# EAGLE design e-box (EAGLE 7.6.0)
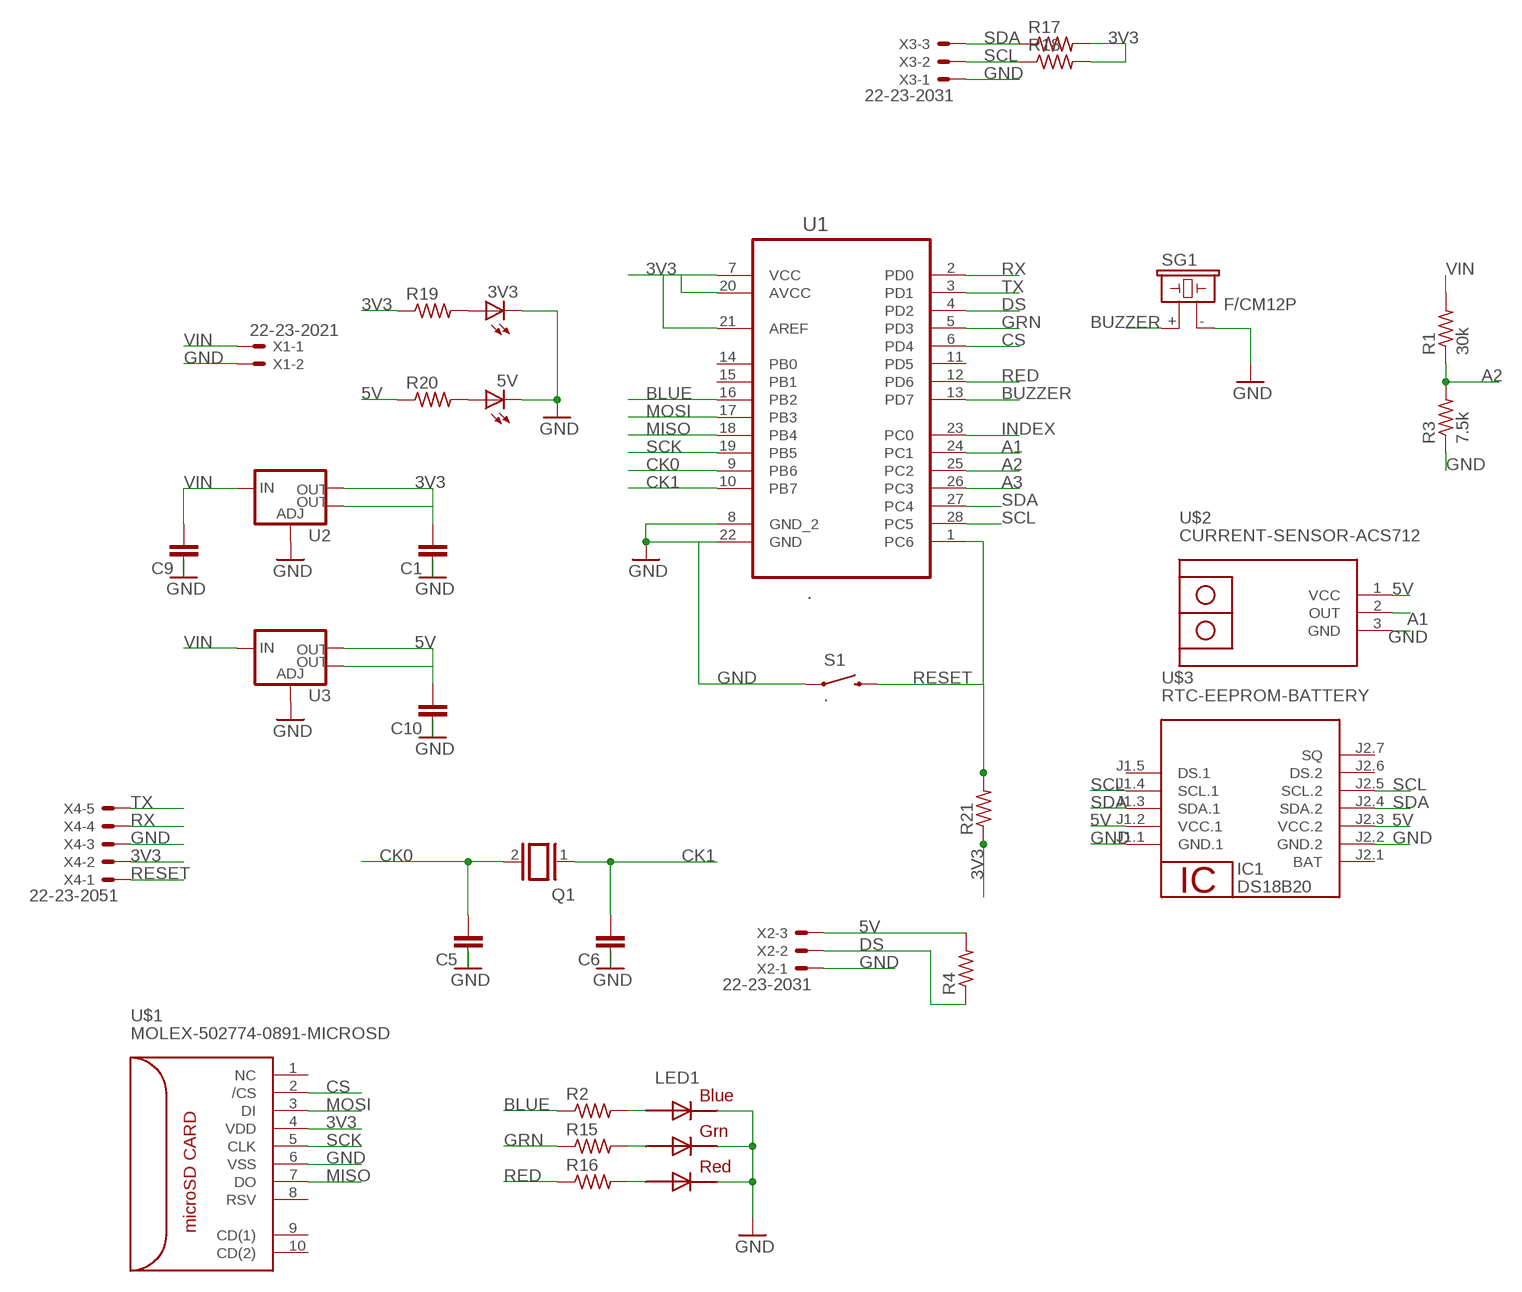
[diagram p0: schematic, sheet 1]

## Parts
3V3  LEDSMT1206  [1206]
5V  LEDSMT1206  [1206]
C1  10UF-1210-50V-20%  [1210]
C5  10UF-1210-50V-20%  [1210]
C6  10UF-1210-50V-20%  [1210]
C9  10UF-1210-50V-20%  [1210]
C10  10UF-1210-50V-20%  [1210]
IC1  DS18B20  [TO92-]
LED1  .  RGBLED5050  [RGBLED5050]
Q1  XTAL/S  [QS]
R1  30k  R-US_M1206  [M1206]
R2  R-US_M1206  [M1206]
R3  7.5k  R-US_M1206  [M1206]
R4  R-US_M1206  [M1206]
R15  R-US_M1206  [M1206]
R16  R-US_M1206  [M1206]
R17  R-US_M1206  [M1206]
R18  R-US_M1206  [M1206]
R19  R-US_M1206  [M1206]
R20  R-US_M1206  [M1206]
R21  R-US_M1206  [M1206]
S1  .  SWITCH-MOMENTARY-2SMD-1101NE  [TACTILE-SWITCH-1101NE]
SG1  F/CM12P  [F/CM12P]
U1  .  ATMEGA328P-PU  [DIP254P762X457-28]
U2  V_REG_LM1117SOT223  [SOT223]
U3  V_REG_LM1117SOT223  [SOT223]
U$1  MOLEX-502774-0891-MICROSD  [MOLEX-502774-0891-MICROSD]
U$2  CURRENT-SENSOR-ACS712  [CURRENT-SENSOR-ACS712]
U$3  RTC-EEPROM-BATTERY  [RTC-EEPROM-BATTERY]
X1  22-23-2021  [22-23-2021]
X2  22-23-2031  [22-23-2031]
X3  22-23-2031  [22-23-2031]
X4  22-23-2051  [22-23-2051]

## Nets
3V3: C1.2 R17.2 R18.2 R19.1 R21.1 U1.7(VCC) U1.20(AVCC) U1.21(AREF) U2.2(OUT) U2.4(OUT) U$1.4(VDD) X4.2
5V: C10.2 R4.2 R20.1 U3.2(OUT) U3.4(OUT) U$2.1(VCC) U$3.J1.2(VCC.1) U$3.J2.3(VCC.2) X2.3
A1: U1.24(PC1) U$2.2(OUT)
A2: R1.1 R3.2 U1.25(PC2)
A3: U1.26(PC3)
BLUE: R2.1 U1.16(PB2)
BUZZER: SG1.+ U1.13(PD7)
CK0: C5.2 Q1.2 U1.9(PB6)
CK1: C6.2 Q1.1 U1.10(PB7)
CS: U1.6(PD4) U$1.2(/CS)
DS: R4.1 U1.4(PD2) X2.2
GND: 3V3.C 5V.C C1.1 C5.1 C6.1 C9.1 C10.1 LED1.4(BLUE_C) LED1.5(RED_C) LED1.6(GREEN_C) R3.1 S1.1 SG1.- U1.8(GND_2) U1.22(GND) U2.1(ADJ) U3.1(ADJ) U$1.6(VSS) U$2.3(GND) U$3.J1.1(GND.1) U$3.J2.2(GND.2) X1.2 X2.1 X3.1 X4.3
GRN: R15.1 U1.5(PD3)
INDEX: U1.23(PC0)
MISO: U1.18(PB4) U$1.7(DO)
MOSI: U1.17(PB3) U$1.3(DI)
N$7: LED1.3(BLUE_A) R2.2
N$8: LED1.1(GREEN_A) R15.2
N$9: LED1.2(RED_A) R16.2
N$11: 3V3.A R19.2
N$12: 5V.A R20.2
RED: R16.1 U1.12(PD6)
RESET: R21.2 S1.2 U1.1(PC6) X4.1
RX: U1.2(PD0) X4.4
SCK: U1.19(PB5) U$1.5(CLK)
SCL: R18.1 U1.28(PC5) U$3.J1.4(SCL.1) U$3.J2.5(SCL.2) X3.2
SDA: R17.1 U1.27(PC4) U$3.J1.3(SDA.1) U$3.J2.4(SDA.2) X3.3
TX: U1.3(PD1) X4.5
VIN: C9.2 R1.2 U2.3(IN) U3.3(IN) X1.1
Unconnected: U1.11(PD5) U1.14(PB0) U1.15(PB1) U$1.1(NC) U$1.8(RSV) U$1.9(CD(1)) U$1.10(CD(2)) U$3.J1.5(DS.1) U$3.J2.1(BAT) U$3.J2.6(DS.2) U$3.J2.7(SQ)

## Power pins joined to a net without a drawn wire
1W: IC1.2
GND: IC1.1
VDD: IC1.3

## Library data of the parts
3V3 5V = adafruit:LED: LED OSRAM: - CHIPLED LG R971, LG N971, LY N971, LG Q971, LY Q971, LO R971, LY R971 LH N974, LH R974 LS Q976, LO Q976, LY Q976 LO Q996 - Hyper CHIPLED LW Q18S LB Q993, LB Q99A, LB R99A - SideLED LS A670, LO A670, LY A670, LG A670, LP A670 LB A673, LV A673, LT A673, LW A673 LH A674 LY A675 LS A676, LA A676, LO A676, LY A676, LW A676 LS A679, LY A679, LG A679 - Hyper Micro SIDELED® LS Y876, LA Y876, LO Y876, LY Y876 LT Y87S - SmartLED LW L88C, LW L88S LB L89C, LB L89S, LG L890 LS L89K, LO L89K, LY L89K LS L896, LA L896, LO L896, LY L896 - TOPLED LS T670, LO T670, LY T670, LG T670, LP T670 LSG T670, LSP T670, LSY T670, LOP T670, LYG T670 LG T671, LOG T671, LSG T671 LB T673, LV T673, LT T673, LW T673 LH T674 LS T676, LA T676, LO T676, LY T676, LB T676, LH T676, LSB T676, LW T676 LB T67C, LV T67C, LT T67C, LS T67K, LO T67K, LY T67K, LW E67C LS E67B, LA E67B, LO E67B, LY E67B, LB E67C, LV E67C, LT E67C LW T67C LS T679, LY T679, LG T679 LS T770, LO T770, LY T770, LG T770, LP T770 LB T773, LV T773, LT T773, LW T773 LH T774 LS E675, LA E675, LY E675, LS T675 LS T776, LA T776, LO T776, LY T776, LB T776 LHGB T686 LT T68C, LB T68C - Hyper Mini TOPLED® LB M676 - Mini TOPLED Santana® LG M470 LS M47K, LO M47K, LY M47K Source: http://www.osram.convergy.de/
C1 C5 C6 C9 C10 = SparkFun-Capacitors:10UF: 10.0µF ceramic capacitors A capacitor is a passive two-terminal electrical component used to store electrical energy temporarily in an electric field.; PROD_ID: CAP-09824; VALUE: 10uF
IC1 = 1wire:DS18B20: Programmable Resolution Digital Thermometer This chip provides a onewire thermosensor with approx. 0.5°C accuracy. A programmable over/undertemperure alarm is available. The precision can be set from 9..12 bits. Notes: Vdd must be applied for accurate measurements at low temperatures, as the parasite power circuit otherwise heats the sensor. If parasite power is used, Vdd has to be connected to GND. The DS1822 is a low-cost thermometer chip, the DS18S20 is similar to the DS18B20, but with 9 Bit precision only. Author: Jan Kandziora <jjj@gmx.de>
LED1 = adafruit:RGBLED: For 5050 RGB LEDs, the order of the LEDs may vary from one manufacturer to another!
Q1 = special:XTAL/S: CRYSTAL
R1-R4 R15-R21 = adafruit:R-US_: RESISTOR, American symbol
S1 = SparkFun-Electromechanical:SWITCH-MOMENTARY-2: Various NO switches- pushbuttons, reed, etc; PROD_ID: SWCH-00815
SG1 = buzzer:F/CM12P: BUZZER Source: Buerklin; OC_FARNELL: unknown; OC_NEWARK: unknown
U1 = Atmel_By_element14_Batch_1-00:ATMEGA328P-PU: 8-bit Microcontroller with In-System Programmable Flash; MPN: ATMEGA328P-PU; OC_FARNELL: 1715487; OC_NEWARK: 15R0268; PACKAGE: PDIP-28; SUPPLIER: Atmel
U2 U3 = SparkFun-IC-Power:V_REG_LM1117: Voltage Regulator LM1117 Standard adjustable voltage regulator but in SMD form. Spark Fun Electronics SKU : COM-00595; PROD_ID: VREG-08170
U$1 = Ava:MOLEX-502774-0891-MICROSD; FARNELL: 2064063
U$2 = diy-modules:CURRENT-SENSOR-ACS712: Isolated Bipolar Current Sensors based on ACS712 chip More details available here: http://embedded-lab.com/blog/a-brief-overview-of-allegro-acs712-current-sensor-part-1/ Click here to find device on ebay.com <http://www.ebay.com/sch/acs712+module> Note: There are many available versions with different pinout. Please check before use
U$3 = diy-modules:RTC-EEPROM-BATTERY: RTC Module with Battery and EEPROM based on DS1307 and AT24C32 chips More details available here: http://henrysbench.capnfatz.com/henrys-bench/arduino-sensors-and-input/arduino-tiny-rtc-d1307-tutorial/ Click here to find device on ebay.com <http://www.ebay.com/sch/tiny+rtc+arduino>
X1 = con-molex:22-23-2021: .100" (2.54mm) Center Header - 2 Pin; MF: MOLEX; MPN: 22-23-2021; OC_FARNELL: 1462926; OC_NEWARK: 25C3832
X2 X3 = con-molex:22-23-2031: .100" (2.54mm) Center Header - 3 Pin; MF: MOLEX; MPN: 22-23-2031; OC_FARNELL: 1462950; OC_NEWARK: 30C0862
X4 = con-molex:22-23-2051: .100" (2.54mm) Center Header - 5 Pin; MF: MOLEX; MPN: 22-23-2051; OC_FARNELL: 1462952; OC_NEWARK: 38C9178

## Net classes
0 default: width 0.406 mm

## Board
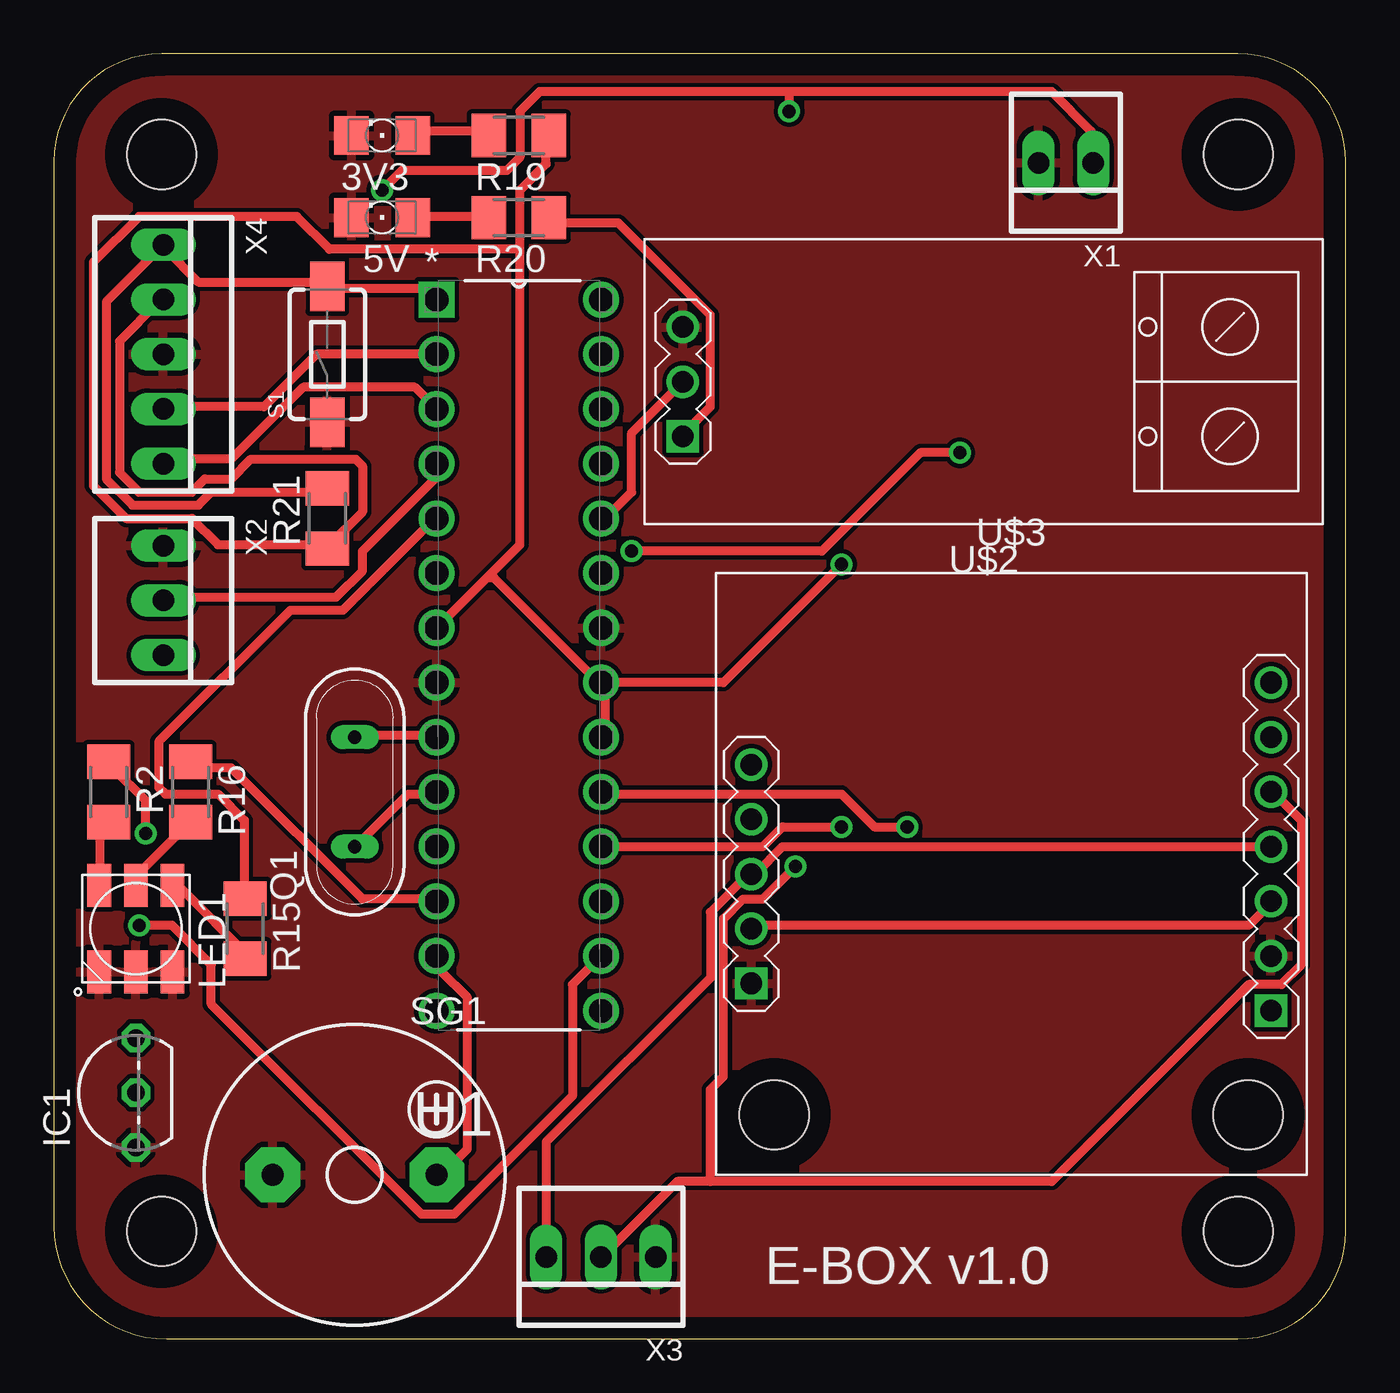
[diagram p1: board, top side]
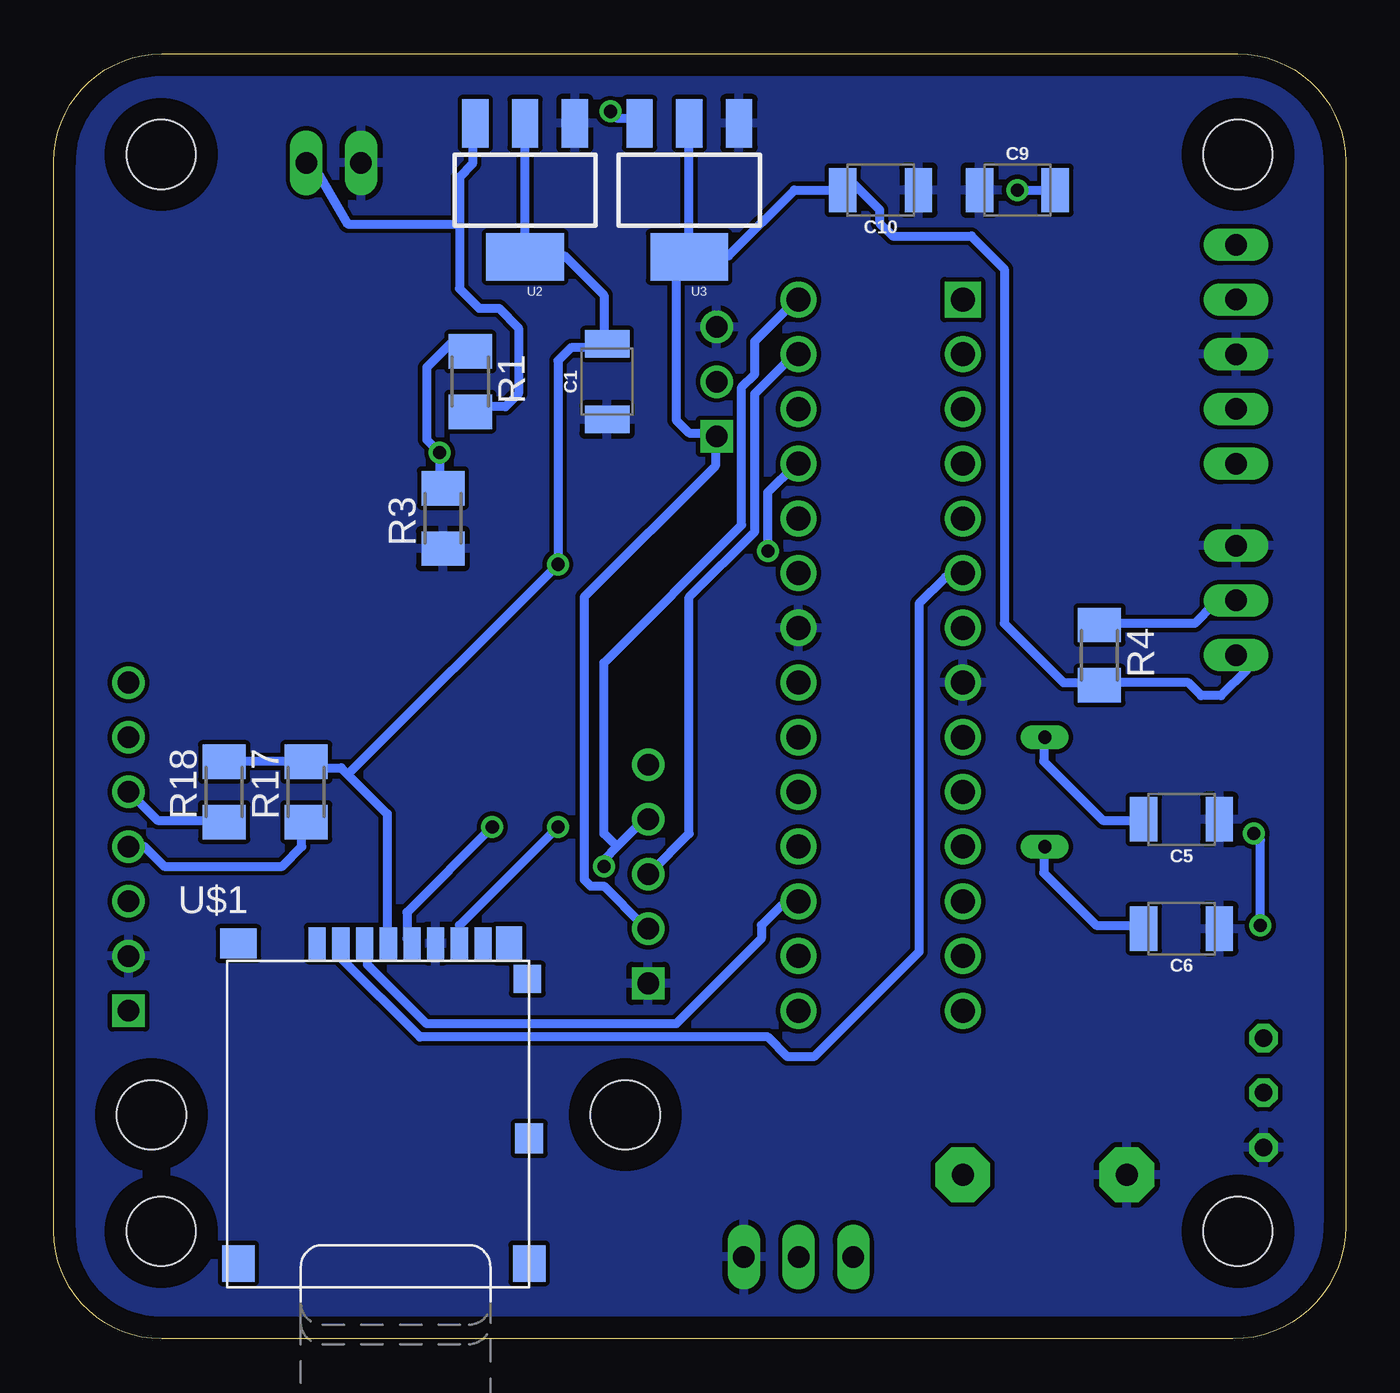
[diagram p2: board, bottom side, seen from below]

Size 59.98 x 59.67 mm. Coordinates in mm from the lower left corner, seen from the top.
Outline: 0,54.67 0,5.24 arc90 5.24,0 54.98,0 arc90 59.98,5 59.98,54.67 arc90 54.98,59.67 5,59.67 arc90 0,54.67
Copper layers (1*16): Top 0.035mm / dielectric 1.5mm / Bottom 0.035mm
Design rules "default": minimum track width 10mil, minimum drill 24mil, track to track 8mil, track to pad 8mil, pad to pad 8mil, via to via 8mil, smd to smd 8mil, copper to edge 40mil, drill to drill 8mil, minimum pad ring 10mil, minimum via ring 8mil, stop-mask expansion 4mil, vias tented up to drill 0mil, thermal gap 10mil
Holes 3.2 mm at 5,5 5,55 55,55 55,5

### Footprints (pad centres in the part's own frame; a part is rotated, then mirrored left to right if it is on the bottom)
1206 = smd 1.6 x 1.803: A -1.422,0; C 1.422,0
1210 = smd 1.27 x 2.06: 1 -1.755,0; 2 1.755,0
TO92- = drill 0.813 octagon: 1 -2.54,0; 2 0,0; 3 2.54,0
RGBLED5050 = smd 2 x 1.1: 1 -2,1.7; 2 -2,0; 3 -2,-1.7; 4 2,-1.7; 5 2,0; 6 2,1.7
QS = drill 0.61 long: 1 -2.54,0; 2 2.54,0
M1206 = smd 1.6 x 2: 1 -1.4,0; 2 1.4,0
TACTILE-SWITCH-1101NE = smd 2.3 x 1.6: 1 -3.15,0; 2 3.15,0
F/CM12P = drill 1.016 pad 2.54 octagon: + 3.81,0; - -3.81,0
DIP254P762X457-28 = drill 1.118 square: 1 -7.62,33.02 | drill 1.118: 2 -7.62,30.48; 3 -7.62,27.94; 4 -7.62,25.4; 5 -7.62,22.86; 6 -7.62,20.32; 7 -7.62,17.78; 8 -7.62,15.24; 9 -7.62,12.7; 10 -7.62,10.16; 11 -7.62,7.62; 12 -7.62,5.08; 13 -7.62,2.54; 14 -7.62,0; 15 0,0; 16 0,2.54; 17 0,5.08; 18 0,7.62; 19 0,10.16; 20 0,12.7; 21 0,15.24; 22 0,17.78; 23 0,20.32; 24 0,22.86; 25 0,25.4; 26 0,27.94; 27 0,30.48; 28 0,33.02
SOT223 = smd 1.219 x 2.235: 1 -2.311,-3.099; 2 0,-3.099; 3 2.311,-3.099 | smd 3.6 x 2.2: 4 0,3.099
MOLEX-502774-0891-MICROSD = smd 0.8 x 1.5: 1 -3.3,8.2; 2 -2.2,8.2; 3 -1.1,8.2; 4 0,8.2; 5 1.1,8.2; 6 2.2,8.2; 7 3.3,8.2; 8 4.4,8.2 | smd 1.29 x 1.3: 9 6.455,6.55 | smd 1.29 x 1.4: 10 6.54,-0.85 | smd 1.5 x 1.7: 11 6.54,-6.65; 12 -6.96,-6.65 | smd 1.7 x 1.4: 14 -6.96,8.2 | smd 1.2 x 1.6: 15 5.6,8.2
CURRENT-SENSOR-ACS712 = drill 1 square: 1 13.97,2.54 | drill 1: 2 13.97,0; 3 13.97,-2.54
RTC-EEPROM-BATTERY = drill 1 square: J1.1 -12.065,-5.08; J2.1 12.065,-6.35 | drill 1: J1.2 -12.065,-2.54; J1.3 -12.065,0; J1.4 -12.065,2.54; J1.5 -12.065,5.08; J2.2 12.065,-3.81; J2.3 12.065,-1.27; J2.4 12.065,1.27; J2.5 12.065,3.81; J2.6 12.065,6.35; J2.7 12.065,8.89 | hole 3.2: -11,-11.176; 11,-11.176
22-23-2021 = drill 1 long: 1 -1.27,0; 2 1.27,0
22-23-2031 = drill 1 long: 1 -2.54,0; 2 0,0; 3 2.54,0
22-23-2051 = drill 1 long: 1 -5.08,0; 2 -2.54,0; 3 0,0; 4 2.54,0; 5 5.08,0

### Placement (x,y rotation side)
3V3  15.24,55.88 180 top
5V  15.24,52.07 180 top
C1  34.29,44.45 90 bottom
C5  7.62,24.13 180 bottom
C6  7.62,19.05 180 bottom
C9  15.24,53.34 0 bottom
C10  21.59,53.34 180 bottom
IC1  3.81,11.43 90 top
LED1  3.81,19.05 270 top
Q1  13.97,25.4 90 top
R1  40.64,44.45 270 bottom
R2  2.54,25.4 270 top
R3  41.91,38.1 90 bottom
R4  11.43,31.75 270 bottom
R15  8.89,19.05 270 top
R16  6.35,25.4 270 top
R17  48.26,25.4 90 bottom
R18  52.07,25.4 90 bottom
R19  21.59,55.88 180 top
R20  21.59,52.07 180 top
R21  12.7,38.1 90 top
S1  12.7,45.72 90 top
SG1  13.97,7.62 0 top
U1  25.4,15.24 0 top
U2  38.1,53.34 180 bottom
U3  30.48,53.34 180 bottom
U$1  44.45,10.16 0 bottom
U$2  43.18,44.45 180 top
U$3  44.45,21.59 0 top
X1  46.99,54.61 180 top
X2  5.08,34.29 270 top
X3  25.4,3.81 180 top
X4  5.08,45.72 270 top

### Tracks (layer width: path | path; a pad name or v marks a point on that pad's centre or on a via)
3V3  (via drill 0.61)
  Top 0.406: X4.2 4.88,48.16 3.05,46.33 3.05,40.23 3.96,39.32 6.4,39.32 7.01,39.93 8.23,39.93 9.14,40.84 14.02,40.84 14.33,40.54 14.33,38.41 12.8,36.88 R21.1 12.5,36.88 7.62,36.88 6.4,38.1 3.35,38.1 1.83,39.62 1.83,49.99 3.96,52.12 11.28,52.12 12.8,50.6 21.64,50.6 | 25.6,30.48 25.6,28.04 U1.20 | 21.64,50.6 21.64,36.88 20.12,35.36 | 21.64,50.6 21.64,53.34 22.86,54.56 22.86,55.78 R19.1 | U1.7 20.12,35.36 | 20.12,35.36 20.42,35.36 25.3,30.48 U1.21 25.6,30.48 | 25.6,30.48 31.09,30.48 v36.58,35.97
  Bottom 0.406: 46.33,26.21 46.63,26.52 48.16,26.52 R17.2 48.46,26.82 51.82,26.82 R18.2 | 46.33,26.21 44.5,24.38 44.5,18.59 U$1.4 | 38.1,50.29 36.27,50.29 34.44,48.46 34.44,46.33 C1.2 34.44,46.02 35.97,46.02 36.58,45.41 v36.58,35.97 46.33,26.21 | 38.1,50.29 U2.2 | 38.1,50.29 U2.4
5V
  Top 0.406: U$3.J1.2 32.61,19.2 55.47,19.2 56.39,20.12 U$3.J2.3 | R20.1 23.16,51.82 26.21,51.82 30.48,47.55 30.48,43.28 29.26,42.06 U$2.1
  Bottom 0.406: X2.3 4.88,31.7 4.57,31.39 4.57,31.09 5.79,29.87 6.71,29.87 7.32,30.48 11.28,30.48 R4.2 11.58,30.48 13.11,30.48 15.85,33.22 15.85,49.68 17.37,51.21 21.03,51.21 21.64,51.82 21.64,52.43 22.86,53.65 23.16,53.65 23.47,53.34 | 23.47,53.34 25.6,53.34 28.65,50.29 30.48,50.29 | 30.48,50.29 U3.2 | 30.48,50.29 U3.4 30.48,49.99 31.09,49.38 31.09,42.67 30.48,42.06 29.26,42.06 U$2.1 29.26,41.76 29.26,40.54 35.36,34.44 35.36,21.34 35.05,21.03 34.44,21.03 32.61,19.2 U$3.J1.2 | 23.47,53.34 C10.2
A1
  Top 0.406: U$2.2 26.82,42.06 26.82,39.32 25.6,38.1 U1.24
A2  (via drill 0.61)
  Top 0.406: v26.82,36.58 35.66,36.58 40.23,41.15 v42.06,41.15
  Bottom 0.406: R3.2 42.06,39.62 v42.06,41.15 42.67,41.76 42.67,45.11 41.45,46.33 41.15,46.33 40.84,46.02 R1.1 | v26.82,36.58 26.82,39.32 25.6,40.54 U1.25
BLUE  (via drill 0.61)
  Top 0.406: v4.27,23.47 4.27,24.99 2.74,26.52 R2.1 | v3.96,19.2 5.49,19.2 7.32,17.37 7.32,15.54 17.07,5.79 18.59,5.79 24.08,11.28 24.08,16.46 U1.16
  Bottom 0.406: v4.27,23.47 3.96,23.16 v3.96,19.2
BUZZER
  Top 0.406: U1.13 17.98,17.68 17.98,17.07 19.2,15.85 19.2,8.84 17.98,7.62 SG1.+
CK0
  Top 0.406: U1.9 17.68,28.04 14.02,28.04 Q1.2
  Bottom 0.406: C5.2 9.45,24.08 11.28,24.08 14.02,26.82 14.02,27.74 Q1.2
CK1
  Top 0.406: U1.10 17.68,25.3 16.46,25.3 14.02,22.86 Q1.1
  Bottom 0.406: C6.2 9.45,19.2 11.58,19.2 14.02,21.64 14.02,22.86 Q1.1
CS
  Bottom 0.406: U$1.2 46.63,18.29 46.63,17.68 42.98,14.02 26.82,14.02 25.91,13.11 24.69,13.11 19.81,17.98 19.81,34.14 18.59,35.36 17.98,35.36 U1.6
DS
  Top 0.406: U1.4 17.68,40.54 17.68,39.93 14.33,36.58 14.33,35.66 13.11,34.44 5.18,34.44 X2.2
  Bottom 0.406: R4.1 11.28,33.22 7.01,33.22 6.1,34.14 5.18,34.14 X2.2
GND
  pour Bottom: 0,5 0,55 arc-90 5,60 55,60 arc-90 60,55 60,5 arc-90 55,0 5,0 arc-90
  pour Top: 55,60 5,60 arc90 0,55 0,5 arc90 5,0 55,0 arc90 60,5 60,55 arc90
GRN
  Top 0.406: R15.1 8.84,20.73 8.84,24.08 7.62,25.3 5.18,25.3 4.88,25.6 4.88,27.74 10.97,33.83 13.41,33.83 17.68,38.1 U1.5
MISO  (via drill 0.61)
  Top 0.406: v36.58,23.77 33.83,23.77 32.92,22.86 U1.18
  Bottom 0.406: v36.58,23.77 41.15,19.2 41.15,18.59 U$1.7
MOSI
  Bottom 0.406: U$1.3 45.41,18.29 45.41,17.37 42.67,14.63 31.09,14.63 27.13,18.59 27.13,19.2 26.21,20.12 25.6,20.12 U1.17
N$7
  Top 0.406: LED1.3 2.13,21.34 2.13,23.47 2.44,23.77 R2.2
N$8
  Top 0.406: LED1.1 5.79,21.03 9.14,17.68 R15.2
N$9
  Top 0.406: LED1.2 3.96,21.34 3.96,21.64 6.1,23.77 R16.2
N$11
  Top 0.406: 3V3.A 16.76,56.08 20.12,56.08 R19.2
N$12
  Top 0.406: 5V.A 16.76,52.12 20.12,52.12 R20.2
RED
  Top 0.406: R16.1 6.4,26.52 8.23,26.52 14.33,20.42 17.68,20.42 U1.12
RESET
  Top 0.406: U1.1 17.68,48.46 17.37,48.77 12.8,48.77 S1.2 12.5,49.07 6.71,49.07 5.18,50.6 X4.1 2.44,48.16 2.44,39.93 3.66,38.71 6.71,38.71 7.32,39.32 12.5,39.32 R21.2
RX
  Top 0.406: U1.2 12.19,45.72 9.75,43.28 5.18,43.28 X4.4
SCK  (via drill 0.61)
  Top 0.406: v39.62,23.77 38.1,23.77 36.58,25.3 25.6,25.3 U1.19
  Bottom 0.406: v39.62,23.77 43.59,19.81 43.59,18.59 U$1.5
SCL  (via drill 0.61)
  Top 0.406: 30.48,7.32 46.33,7.32 55.47,16.46 57,16.46 57.91,17.37 57.91,24.08 56.69,25.3 U$3.J2.5 | 30.48,7.32 28.96,7.32 25.6,3.96 X3.2 | v34.44,21.95 32.92,20.42 32,20.42 31.09,19.51 31.09,12.19 30.48,11.58 30.48,7.32
  Bottom 0.406: R18.1 52.12,24.08 55.17,24.08 56.08,24.99 56.08,25.3 56.39,25.6 U$3.J2.5 | 33.83,22.86 34.44,22.25 v34.44,21.95 | 33.83,22.86 32.61,24.08 U$3.J1.4 | 33.83,22.86 34.44,23.47 34.44,31.39 28.04,37.8 28.04,44.2 27.43,44.81 27.43,46.33 25.6,48.16 U1.28
SDA
  Top 0.406: X3.3 22.86,9.14 30.48,16.76 30.48,19.81 32.31,21.64 U$3.J1.3 32.61,21.64 33.83,22.86 U$3.J2.4
  Bottom 0.406: U$3.J2.4 55.78,22.86 54.86,21.95 49.38,21.95 48.46,22.86 48.46,23.77 R17.1 | U1.27 25.6,45.72 27.43,43.89 27.43,37.49 30.48,34.44 30.48,23.47 32.31,21.64 U$3.J1.3
TX
  Top 0.406: U1.3 16.76,44.2 11.58,44.2 8.23,40.84 5.18,40.84 X4.5
VIN  (via drill 0.61)
  Top 0.406: v15.24,53.34 16.15,54.25 21.03,54.25 21.64,54.86 21.64,57 22.55,57.91 34.14,57.91 | 34.14,57.91 46.33,57.91 48.16,56.08 X1.1 | 34.14,57.91 v34.14,57
  Bottom 0.406: 41.15,51.77 41.15,53.95 40.54,54.56 40.54,56.39 U2.3 | 41.15,51.77 41.15,48.77 40.23,47.85 39.32,47.85 38.41,46.94 38.41,43.89 39.01,43.28 40.54,43.28 R1.2 | v15.24,53.34 C9.2 | v34.14,57 33.83,56.69 32.92,56.69 U3.3 | 41.15,51.77 46.33,51.77 48.16,54.86 48.16,55.78 X1.1

### Text on the board
tPlace: E-BOX v1.0